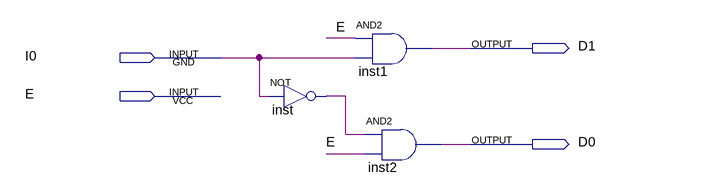
[diagram p0: schematic sheet]
// Quartus schematic DC2.bdf as structural Verilog: 3 symbols, 4 pins
module DC2 (
  input  I0,
  input  E,
  output D1,
  output D0
);

  wire inst_out;

  not inst (inst_out, I0);
  and inst1 (D1, E, I0);
  and inst2 (D0, inst_out, E);
endmodule
